# Altium schematic sheet 6v_BOOST.SchDoc
size Letter; Author: Lihong; Chenwei; SheetNumber: 7; SheetTotal: 8
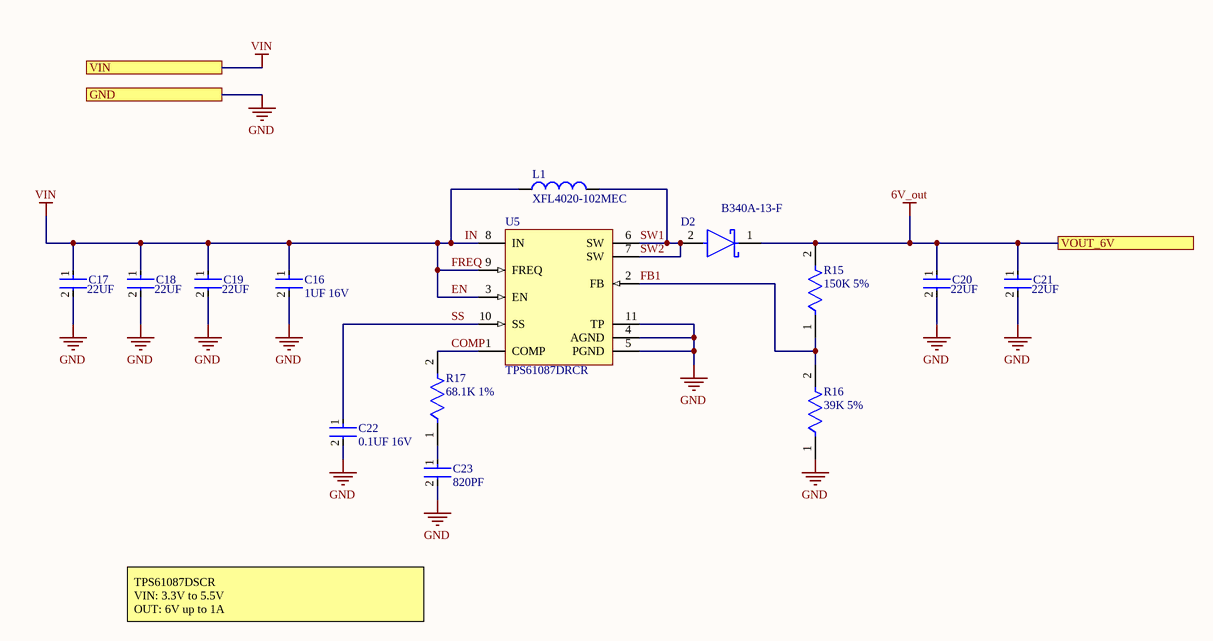
[diagram p0: 6v_BOOST.SchDoc]

## Parts
C16  1UF 16V  [FP-CC0603-DA-MFG]
C17  22UF  [FP-CC0805-0_2-1_45-IPC_C]
C18  22UF  [FP-CC0805-0_2-1_45-IPC_C]
C19  22UF  [FP-CC0805-0_2-1_45-IPC_C]
C20  22UF  [FP-CC0805-0_2-1_45-IPC_C]
C21  22UF  [FP-CC0805-0_2-1_45-IPC_C]
C22  0.1UF 16V  [FP-CC0402-MFG]
C23  820PF  [FP-CC0402-MFG]
D2  B340A-13-F  [FP-SMA-MFG]
L1  XFL4020-102MEC  [COIL-XFL4020_V]
R15  150K 5%  [FP-RMCF0603-IPC_A]
R16  39K 5%  [FP-RMCF0603-IPC_B]
R17  68.1K 1%  [FP-RMCF0402-IPC_C]
U5  TPS61087DRCR  [DRC0010J_V]

## Ports
GND, VIN, VOUT_6V

## Nets
6V_out: C20.1 C21.1 D2.1(C) R15.2 ; port VOUT_6V
EN: C16.1 C17.1 C18.1 C19.1 L1.1 U5.3(EN) U5.8(IN) U5.9(FREQ) ; port VIN  [also labelled FREQ, IN, VIN]
GND: C16.2 C17.2 C18.2 C19.2 C20.2 C21.2 C22.2 C23.2 R16.1 U5.4(AGND) U5.5(PGND) U5.11(TP) ; port GND
COMP: R17.2 U5.1(COMP)
FB1: R15.1 R16.2 U5.2(FB)
SS: C22.1 U5.10(SS)
SW1: D2.2(A) L1.2 U5.6(SW) U5.7(SW)  [also labelled SW2]
NetC23_1: C23.1 R17.1

## Notes on the sheet
- TPS61087DSCR
  VIN: 3.3V to 5.5V
  OUT: 6V up to 1A
- Title:
- Desc:
- Size:
- Letter
- Auth:
- Proj:
- Sheet
- of
- www.seas.upenn.edu
- Electrical and Systems Engineering

## Library data of the parts
C16 = CMP-03422-001047-1: CC0603 1 uF X7R 10.00% 16 V; Manufacturer: YAGEO; Manufacturer Part Number: CC0603KPX7R7BB105; Temperature Coefficient: 15%; Tolerance: 0.1; Material: Ceramic; Device Class L3: Ceramic Capacitors; Temperature Characteristic: X7R; Device Class L2: Capacitors; Temperature Range Low: -55°C; Footprint Url: http://www.yageo.com/exep/pages/download/literatures/UPY-C_GEN_24.pdf; Device Class L1: Passive Components; Temperature: -55°C to +125°C; Voltage Rating: 16 V; RoHS: TRUE; ComponentLink2URL: http://www.yageo.com/documents/recent/UPY-GPHC_X7R_6.3V-to-50V_18.pdf; Mouser Description: Cap Ceramic 1uF 16V X7R 10% SMD 0603 125°C Paper T/R; Octopart: https://octopart.com/cc0603kpx7r7bb105-yageo-25629533; Automotive: No; Capacitance: 1 uF; Height: 0.9mm; Voltage: 16 V; Lead Free: Yes; Category: Cap; Package: CC0603-DA; Temperature Range High: +125°C; Value: 1 uF; ComponentLink2Description: Datasheet
C17-C21 = CMP-03422-001497-1: CAP CER 22UF 25V X5R 0805; Tolerance: 20%; Max Operating Temperature: 85°C; Dielectric: X5R; Termination: SMD/SMT; Voltage Rating: 25V; Width: 0.049inch; Min Operating Temperature: -55°C; Case/Package: 0805; Lead Free: Lead Free; RoHS Compliant: Yes; Weight: 0.000194oz; Voltage Rating (DC): 25V; Capacitance: 22uF; Length: 0.079inch; Halogen Free: Halogen Free; Height: 1.25mm; Packaging: Tape and Reel; Package Quantity: 3000; Case Code (Metric): 2012; Thickness: 0.057inch; Case Code (Imperial): 0805; Mount: Surface Mount
C22 = CMP-03422-000946-1: CC0402 100 nF X7R 10.00% 25 V; Manufacturer Part Number: CC0402KPX7R8BB104; Manufacturer: YAGEO; Capacitance: 100 nF; Material: Ceramic; Tolerance: 0.1; Value: 100 nF; Temperature Coefficient: 30ppm/°C; Automotive Grade: NA; Voltage Rating: 25 V; Footprint Url: http://www.yageo.com/exep/pages/download/literatures/UPY-C_GEN_24.pdf; ComponentLink2Description: Datasheet; Device Class L2: Capacitors; Device Class L3: Ceramic Capacitors; Height: 0.55mm; Ipc Land Pattern Name: CAPC10050X50; Category: Cap; ComponentLink2URL: http://www.yageo.com/documents/recent/UPY-GP_NP0_16V-to-50V_16.pdf; Automotive: No; Temperature: -55°C to +125°C; Lead Free: Yes; Temperature Range High: +125°C; Temperature Range Low: -55°C; Temperature Characteristic: X7R; Package: CC0402; RoHS: TRUE; Octopart: https://octopart.com/cc0402kpx7r8bb104-yageo-61757486; Device Class L1: Passive Components
C23 = CMP-2002-03061-2: CAP CER 820PF 50V X7R 0402; Manufacturer Part Number: CC0402KRX7R9BB821; Manufacturer: YAGEO; Material: Ceramic; Temperature Coefficient: 30ppm/°C; Tolerance: 0.1; Automotive Grade: NA; RoHS: TRUE; Device Class L1: Passive Components; Temperature: -55°C to +125°C; Capacitance: 820 pF; Footprint Url: http://www.yageo.com/exep/pages/download/literatures/UPY-C_GEN_24.pdf; Automotive: No; Height: 0.55mm; Lead Free: Yes; Temperature Characteristic: X7R; Device Class L3: Ceramic Capacitors; Voltage Rating: 50 V; Ipc Land Pattern Name: CAPC10050X50; Mouser Description: 0402 820 pF 50 V ±10 % Tolerance X7R SMT Multilayer Ceramic Capacitor; Package: CC0402; Temperature Range Low: -55°C; ComponentLink2URL: http://www.yageo.com/documents/recent/UPY-GP_NP0_16V-to-50V_16.pdf; Digikey Description: CAP CER 820PF 50V X7R 0402; Temperature Range High: +125°C; Category: Cap; ComponentLink2Description: Datasheet; Value: 820 pF; Device Class L2: Capacitors; Octopart: https://octopart.com/cc0402krx7r9bb821-yageo-9291732
D2 = CMP-1667-00003-3: DIODE SCHOTTKY 40V 3A SMA; Forward Voltage: 500mV; Max Forward Surge Current (Ifsm): 80A; Polarity: Standard; Max Reverse Current: 500uA; Capacitance: 250pF; Element Configuration: Single; Min Operating Temperature: -55°C; Mount: Surface Mount; Max Operating Temperature: 125°C; Radiation Hardening: No; Length: 4.6mm; Height: 2.3mm; Forward Current: 3A; Packaging: Tape and Reel; Package Quantity: 5000; REACH SVHC: No SVHC; Width: 2.92mm; Output Current: 3A; Current Rating: 3A; Termination: SMD/SMT; Voltage: 40V; Series: -; Current: 3A; Max Repetitive Reverse Voltage (Vrrm): 40V; Number of Pins: 2; Average Rectified Current: 3A; Contact Plating: Tin; RoHS Compliant: Yes; Max Reverse Voltage (DC): 40V; Case/Package: SMA; Weight: 0.002258oz; Peak Non-Repetitive Surge Current: 80A; Lead Free: Lead Free; Voltage Rating (DC): 40V
L1 = CMP-2000-07423-1: Shielded Power Inductor, 1 uH, 64 MHz, -40 to 125 degC, 2-Pin SMD, RoHS, Tape and Reel; Manufacturer: Coilcraft; Case Width: 4.3mm; Case Height: 2.1mm; Maximum DC Current: 11A; Core Material: Composite; Test Frequency: 100kHz; Tolerance: 20%; Maximum DC Resistance: 11.9mOhms; Inductance: 1uH; Self Resonant Frequency: 64MHz; RoHS: Details; Series: XFL4020; Case Length: 4.3mm; Package Reference: XFL4020; Dimensions: 4.3mmWx4.3mmLx2.1mmH; Product: PowerInductors; Datasheet Version: 07/2012; Manufacturer URL: http://www.coilcraft.com/; Termination Style: SMD/SMT; Mounting Technology: SurfaceMount; Operating Temperature Range: -40Cto+125C; Package Description: 2-Pin Surface Mount Device, Body 4 x 4 mm, Pitch 2.37 mm; Shielding: Shielded; Packaging: Reel; Datasheet URL: http://www.mouser.com/ds/2/597/xfl4020-270756.pdf
R15 = CMP-26527-004955-1: 150kΩ ±5% 0.1W 0603 Thick Film Chip Resistor AEC-Q200 compliant; Max Power Dissipation: 100mW; Temperature Coefficient: 200ppm/°C; Resistance: 150kR; Features: Automotive AEC-Q200; Width: 0.031inch; Max Operating Temperature: 155°C; Size Code: 0603; Mount: Surface Mount; Resistor Type: Thick Film; Number of Terminations: 2; Height: 0.022inch; Construction: Rectangular; Radiation Hardening: No; Series: RMCF; Case/Package: 0603; Length: 0.061inch; Case Code (Metric): 1608; Military Standard: Not; Tolerance: 5%; Packaging: Tape and Reel; Depth: 0.8mm; Power Rating: 100mW; Contact Plating: Tin; Case Code (Imperial): 0603; Min Operating Temperature: -55°C; RoHS Compliant: Yes; Lead Free: Lead Free
R16 = CMP-26527-002854-1: 39kΩ ±5% 0.1W 0603 Thick Film Chip Resistor AEC-Q200 compliant; Working Voltage: 75V; Power Rating: 100mW; Resistance: 39kR; Temperature Coefficient: 200ppm/°C; Case/Package: 0603; Packaging: Tape and Reel; Case Code (Metric): 1608; Technology: THICK FILM; Series: RMCF; Min Operating Temperature: -55°C; Radiation Hardening: No; Mount: Surface Mount; Height: 0.022inch; Width: 0.031inch; Contact Plating: Tin; Package Quantity: 5000; Max Power Dissipation: 100mW; RoHS Compliant: Yes; Length: 0.061inch; Number of Terminations: 2; Max Operating Temperature: 155°C; Features: Automotive AEC-Q200; Lead Free: Lead Free; Tolerance: 5%; Case Code (Imperial): 0603; Resistor Type: Thick Film
R17 = CMP-26527-007353-1: 68.1kΩ ±1% 0.063W 0402 Thick Film Chip Resistor AEC-Q200 compliant; Power Rating: 63mW; Resistance: 68.1kR; Temperature Coefficient: 100ppm/°C; Lead Free: Lead Free; Size Code: 0402; Case/Package: 0402; RoHS Compliant: Yes; Mount: Surface Mount; Height: 0.016inch; Number of Terminations: 2; Case Code (Imperial): 0402; Max Operating Temperature: 155°C; Radiation Hardening: No; Contact Plating: Tin; Resistor Type: Thick Film; Features: Automotive AEC-Q200; Package Quantity: 10000; Max Power Dissipation: 63mW; Width: 0.02inch; Min Operating Temperature: -55°C; Series: RMCF; Case Code (Metric): 1005; Length: 0.039inch; Packaging: Tape and Reel; Tolerance: 1%
U5 = CMP-0343-00035-2: Boost Voltage Converter with 2.5 to 6 V Input and 3 to 18.5 V Output, -40 to 85 degC, 10-Pin SON (DRC), Green (RoHS & no Sb/Br); Manufacturer: Texas Instruments; Vout(Max)(V): 18.5; Switching Frequency(Typ)(kHz): 650, 1200; SubFamily: Step-Up Regulator; Regulated Outputs(#): 1; Vout(Min)(V): 3; Vin(Min)(V): 2.5; Vin(Max)(V): 6; PartNumber: TPS61087DRCR; ComponentLink1Description: Datasheet; Mounting Technology: Surface Mount; Eco-Plan: Green (RoHS & no Sb/Br); Topology: Boost; PackageVersion: revL, Sep-2011; DatasheetVersion: SLVS821B; ComponentLink1URL: http://www.ti.com/general/docs/lit/getliterature.tsp?genericPartNumber=TPS61087&fileType=pdf; ComponentLink2URL: http://www.ti.com/litv/pdf/mpds117k; ComponentLink2Description: Package Specification; PackageDescription: 10-Pin Plastic Small Outline No-Lead, 3 x 3 x 1 mm Body, 0.5 mm Pitch, Exposed Pad; PackageReference: DRC0010J